# Altium schematic sheet DM9051.SchDoc
size B
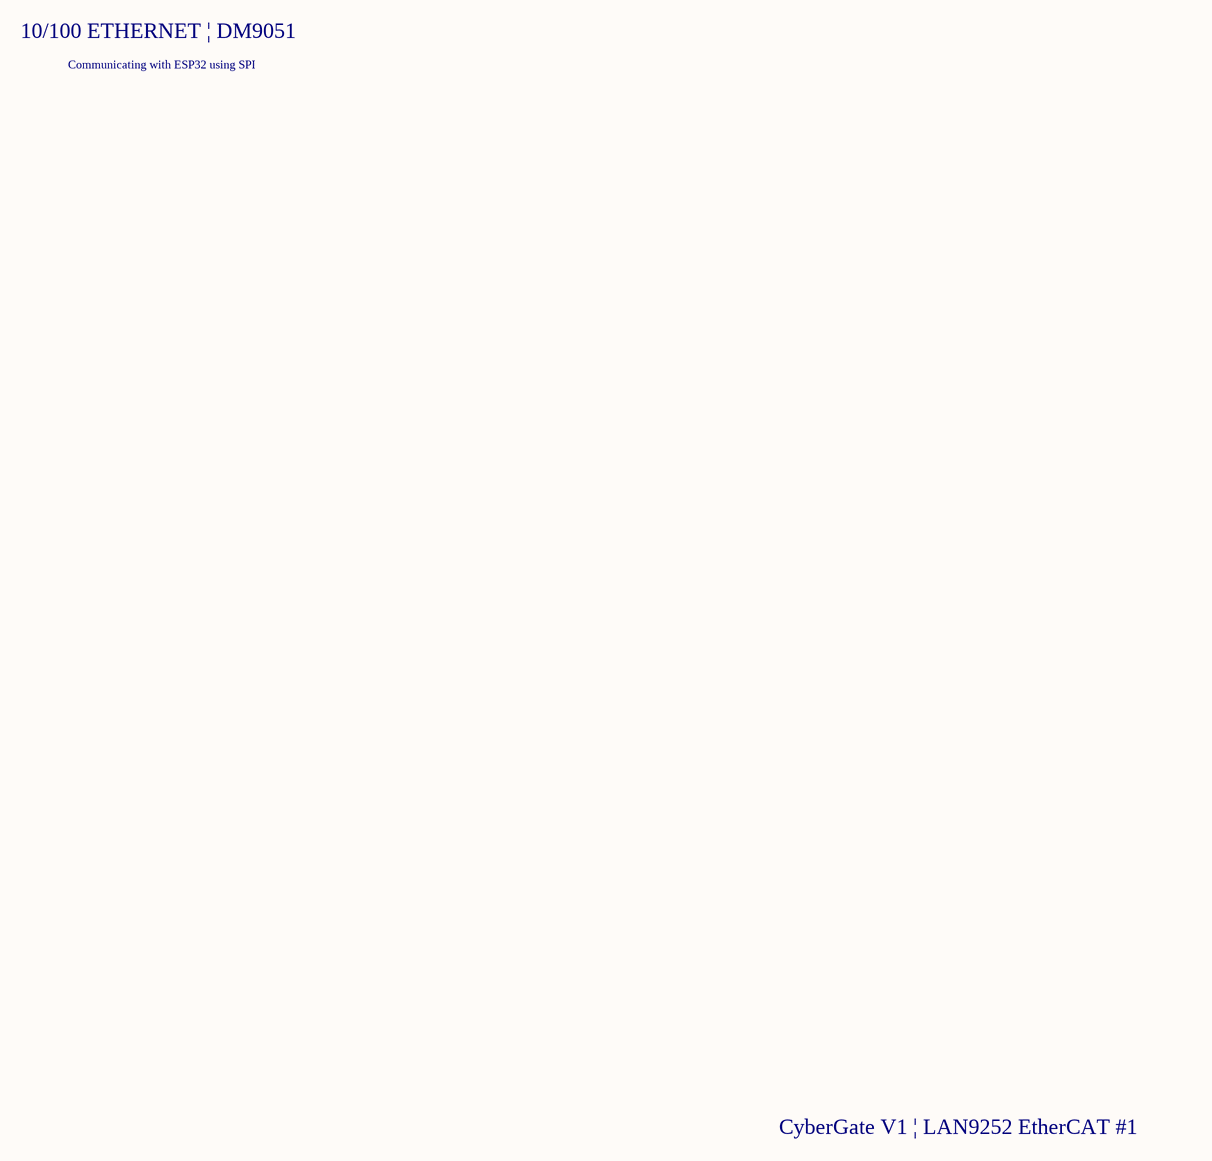
[diagram p0: DM9051.SchDoc]

## Notes on the sheet
- 10/100 ETHERNET | DM9051
- Communicating with ESP32 using SPI
- CyberGate V1 | LAN9252 EtherCAT #1